# Altium schematic sheet PowerSystem.SchDoc
size A
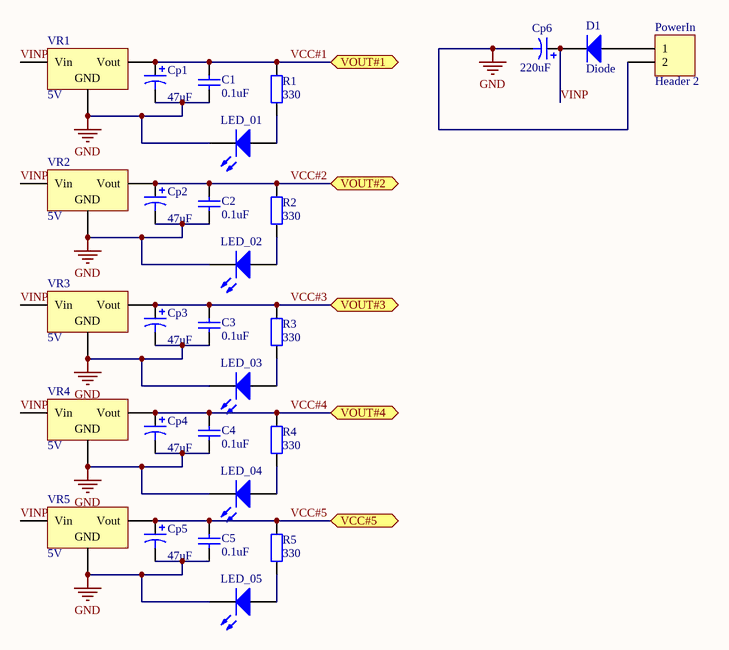
[diagram p0: PowerSystem.SchDoc]

## Parts
C1  value 0.1uF  [6-0805_N]  (hidden comment: Cap Semi)
C2  value 0.1uF  [6-0805_N]  (hidden comment: Cap Semi)
C3  value 0.1uF  [6-0805_N]  (hidden comment: Cap Semi)
C4  value 0.1uF  [6-0805_N]  (hidden comment: Cap Semi)
C5  value 0.1uF  [6-0805_N]  (hidden comment: Cap Semi)
Cp1  value 47uF  [1CA470WR]  (hidden comment: Cap Pol3)
Cp2  value 47uF  [1CA470WR]  (hidden comment: Cap Pol3)
Cp3  value 47uF  [1CA470WR]  (hidden comment: Cap Pol3)
Cp4  value 47uF  [1CA470WR]  (hidden comment: Cap Pol3)
Cp5  value 47uF  [1CA470WR]  (hidden comment: Cap Pol3)
Cp6  value 220uF  [1CA470WR]  (hidden comment: Cap Pol3)
D1  Diode  [SMC]
LED_01  LED2  [3.2X1.6X1.1]  (value not drawn)
LED_02  LED2  [3.2X1.6X1.1]  (value not drawn)
LED_03  LED2  [3.2X1.6X1.1]  (value not drawn)
LED_04  LED2  [3.2X1.6X1.1]  (value not drawn)
LED_05  LED2  [3.2X1.6X1.1]  (value not drawn)
PowerIn  Header 2  [Power Terminals]
R1  value 330  [J1-0603]  (hidden comment: Res2)
R2  value 330  [J1-0603]  (hidden comment: Res2)
R3  value 330  [J1-0603]  (hidden comment: Res2)
R4  value 330  [J1-0603]  (hidden comment: Res2)
R5  value 330  [J1-0603]  (hidden comment: Res2)
VR1  5V  [SOT223_N]
VR2  5V  [SOT223_N]
VR3  5V  [SOT223_N]
VR4  5V  [SOT223_N]
VR5  5V  [SOT223_N]

## Ports
VCC#5, VOUT#1, VOUT#2, VOUT#3, VOUT#4

## Nets
GND: C1.1 C2.1 C3.1 C4.1 C5.1 Cp1.2 Cp2.2 Cp3.2 Cp4.2 Cp5.2 Cp6.2 LED_01.2(K) LED_02.2(K) LED_03.2(K) LED_04.2(K) LED_05.2(K) PowerIn.2 VR1.2(GND) VR2.2(GND) VR3.2(GND) VR4.2(GND) VR5.2(GND)
VCC#1: C1.2 Cp1.1 R1.2 VR1.3(Vout) ; port VOUT#1
VCC#2: C2.2 Cp2.1 R2.2 VR2.3(Vout) ; port VOUT#2
VCC#3: C3.2 Cp3.1 R3.2 VR3.3(Vout) ; port VOUT#3
VCC#4: C4.2 Cp4.1 R4.2 VR4.3(Vout) ; port VOUT#4
VCC#5: C5.2 Cp5.1 R5.2 VR5.3(Vout) ; port VCC#5
VINP: Cp6.1 D1.2(K) VR1.1(Vin) VR2.1(Vin) VR3.1(Vin) VR4.1(Vin) VR5.1(Vin)
NetD1_1: D1.1(A) PowerIn.1
NetLED_01_1: LED_01.1(A) R1.1
NetLED_02_1: LED_02.1(A) R2.1
NetLED_03_1: LED_03.1(A) R3.1
NetLED_04_1: LED_04.1(A) R4.1
NetLED_05_1: LED_05.1(A) R5.1

## Library data of the parts
C1-C5 = Cap Semi: Capacitor (Semiconductor SIM Model); Published: 8-Jun-2000; LatestRevisionDate: 29-May-2009; LatestRevisionNote: IPC-7351 Footprint Added.; PackageReference: C1206; Publisher: Altium Limited; PackageDescription: Chip Capacitor
Cp1-Cp6 = Cap Pol3: Polarized Capacitor (Surface Mount); Published: 8-Jun-2000; LatestRevisionDate: 29-May-2009; LatestRevisionNote: IPC-7351 Footprint Added.; PackageReference: C0805; Publisher: Altium Limited; PackageDescription: Chip Capacitor
D1 = Diode: Default Diode; Published: 8-Jun-2000; LatestRevisionDate: 17-Jul-2002; LatestRevisionNote: Re-released for DXP Platform.; PackageVersion: Sep-1996; PackageReference: SMC; Publisher: Altium Limited; PackageDescription: DO-214-AB/SMC; 2 C-Bend Leads; Body 7.9 x 5.9 mm, inc. leads (LxW); Code_JEDEC: DO-214-AB
LED_01 LED_02 LED_03 LED_04 LED_05 = LED2: Typical RED, GREEN, YELLOW, AMBER GaAs LED; Published: 8-Jun-2000; LatestRevisionDate: 17-Jul-2002; LatestRevisionNote: Re-released for DXP Platform.; PackageVersion: Feb-2002; PackageReference: 3.2X1.6X1.1; Publisher: Altium Limited; PackageDescription: SM LED; 2 Flat Leads
PowerIn = Header 2: Header, 2-Pin; LatestRevisionDate: 17-Jul-2002; LatestRevisionNote: Re-released for DXP Platform.; Publisher: Altium Limited
R1-R5 = Res2: Resistor; Published: 8-Jun-2000; LatestRevisionDate: 17-Jul-2002; LatestRevisionNote: Re-released for DXP Platform.; PackageReference: AXIAL-0.4; Publisher: Altium Limited; PackageDescription: Axial Device, Thru-Hole; 2 Leads; 0.4 in Pin Spacing
VR1-VR5 = Volt Reg: Voltage Regulator; pin to pad: 1>3 2>1 3>2; Published: 24-Mar-1999; LatestRevisionDate: 29-May-2009; LatestRevisionNote: IPC-7351 Footprint Added.; PackageReference: D2PAK; Publisher: Altium Limited; PackageDescription: 3-Pin Transistor Outline Package 2.54 mm Pitch, 15.1 mm Lead Span